# Altium schematic sheet USB-C.SchDoc
size A4; SheetNumber: 4; SheetTotal: 5
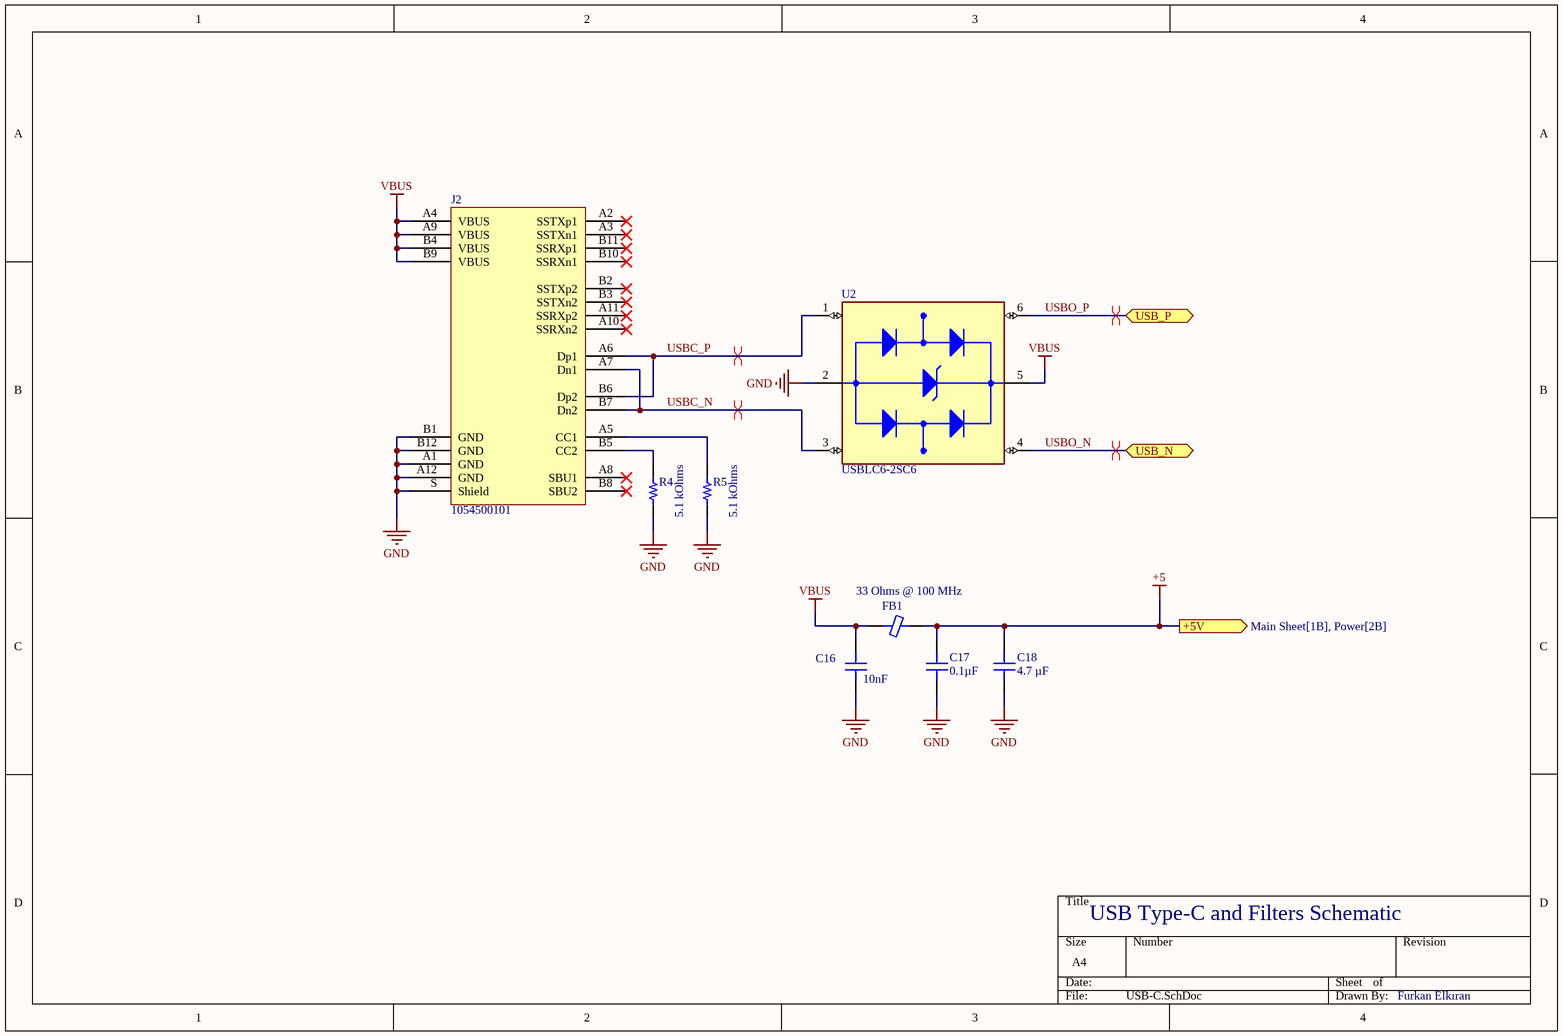
[diagram p0: USB-C.SchDoc]

## Parts
C16  Capacitance: 10nF  [CAP 0402_1005]  (hidden comment: 10000pF)
C17  0.1µF  [CAP 0402_1005]
C18  4.7 µF  [CAP 0805_2012]
FB1  33 Ohms @ 100 MHz  [FER 0402_1005]
J2  1054500101  [Molex 1054500101]
R4  5.1 kOhms  [YAGEO RES 0402_1005]
R5  5.1 kOhms  [YAGEO RES 0402_1005]
U2  USBLC6-2SC6  [SOT95P280X145-6N]

## Ports
+5V (out, see Main Sheet[1B], Power[2B]), USB_N (bidir, see Main Sheet[2B], ESP32-S3[3B]), USB_P (bidir, see Main Sheet[2B], ESP32-S3[3B])

## Nets
+5: C17.2 C18.2 FB1.2 ; port +5V
GND: C16.1 C17.1 C18.1 J2.A1(GND) J2.A12(GND) J2.B1(GND) J2.B12(GND) J2.S(Shield) R4.1 R5.1 U2.2(GND)
VBUS: C16.2 FB1.1 J2.A4(VBUS) J2.A9(VBUS) J2.B4(VBUS) J2.B9(VBUS) U2.5(VBUS)
USBC_N: J2.A7(Dn1) J2.B7(Dn2) U2.3(I/O2_IN)
USBC_P: J2.A6(Dp1) J2.B6(Dp2) U2.1(I/O1_IN)
USBO_N: U2.4(I/O2_OUT) ; port USB_N
USBO_P: U2.6(I/O1_OUT) ; port USB_P
NetJ2_A5: J2.A5(CC1) R5.2
NetJ2_B5: J2.B5(CC2) R4.2

Not connected (* = marked no-connect by the designer): J2 A2(SSTXp1)* A3(SSTXn1)* A8(SBU1)* A10(SSRXn2)* A11(SSRXp2)* B2(SSTXp2)* B3(SSTXn2)* B8(SBU2)* B10(SSRXn1)* B11(SSRXp1)*

## Layout directives
differential pair: USBC_N, USBC_P, USBO_N, USBO_P

## Notes on the sheet
- USB Type-C and Filters Schematic
- Furkan Elkıran

## Library data of the parts
C16 = 0402YC103JAT4A: CAP CER 10000PF 16V X7R 0402; manufacturer: AVX Corporation; Tolerance: ±5%; Part Number: 0402YC103JAT4A; Applications: General Purpose; componentlink1description: Datasheet; componentlink1url: http://datasheets.avx.com/X7RDielectric.pdf; componentlink2description: DigiKey Link; componentlink2url: http://digikey.com/product-detail/en/avx-corporation/0402YC103JAT4A/478-12448-1-ND/9749300; Device Package: 0402 (1005 Metric); lastupdated: 8.02.2022 12:26:50; Lifecycle Status: Active; Minimum Order: 1; Mounting Type: Surface Mount, MLCC; Operating Temperature: -55°C ~ 125°C; Package / Case: 0402 (1005 Metric); packaging: TapeAndReel; partid: 6953; Part Status: Active; price: 0.06; series: -; Size / Dimension: 0.039" L x 0.020" W (1.00mm x 0.50mm); Supplier 1: DigiKey; Supplier Part Number 1: 478-12448-1-ND; Temperature Coefficient: X7R; Thickness (Max): 0.022" (0.56mm); value: 10000pF; Voltage - Rated: 16V
C17 = 0402YC104JAT4A: CAP CER 0.1UF 16V X7R 0402; manufacturer: AVX Corporation; Tolerance: ±5%; Part Number: 0402YC104JAT4A; Capacitance: 0.1µF; Applications: General Purpose; componentlink1description: Datasheet; componentlink1url: http://datasheets.avx.com/X7RDielectric.pdf; componentlink2description: DigiKey Link; componentlink2url: http://digikey.com/product-detail/en/avx-corporation/0402YC104JAT4A/478-11502-1-ND/8107703; Device Package: 0402 (1005 Metric); lastupdated: 8.02.2022 12:26:57; Lifecycle Status: Active; Minimum Order: 1; Mounting Type: Surface Mount, MLCC; Operating Temperature: -55°C ~ 125°C; Package / Case: 0402 (1005 Metric); packaging: CutTape; partid: 2382; Part Status: Active; price: 0.10; series: -; Size / Dimension: 0.039" L x 0.020" W (1.00mm x 0.50mm); Supplier 1: DigiKey; Supplier Part Number 1: 478-11502-1-ND; Temperature Coefficient: X7R; Thickness (Max): 0.022" (0.56mm); value: 0.1µF; Voltage - Rated: 16V
C18 = C0805C475J4RACAUTO: CAP CER 4.7UF 16V X7R 0805; manufacturer: KEMET; Tolerance: ±5%; Part Number: C0805C475J4RACAUTO; Capacitance: 4.7 µF; Applications: Automotive, Bypass, Decoupling; componentlink1description: Datasheet; componentlink1url: https://api.kemet.com/component-edge/download/datasheet/C0805C475J4RACAUTO.pdf; componentlink2description: DigiKey Link; componentlink2url: https://www.digikey.com/en/products/detail/kemet/C0805C475J4RACAUTO/7427546; Device Package: 0805 (2012 Metric); lastupdated: 9.02.2024 20:15:37; Lifecycle Status: Active; Minimum Order: 1; Mounting Type: Surface Mount, MLCC; Operating Temperature: -55°C ~ 125°C; Package / Case: 0805 (2012 Metric); packaging: TapeAndReel; partid: 39263; Part Status: Active; price: 0.12; Ratings: AEC-Q200; series: SMD Auto X7R; Size / Dimension: 0.079" L x 0.049" W (2.00mm x 1.25mm); Supplier 1: DigiKey; Supplier Part Number 1: 399-15716-1-ND; Temperature Coefficient: X7R; Thickness (Max): 0.055" (1.40mm); value: 4.7 µF; Voltage - Rated: 16V
FB1 = FB100505T-330Y-S: FBEAD 0402 33 OHM .40DC 300MA; Manufacturer: Cal-Chip Electronics, Inc.; DC Resistance (DCR) (Max): 400mOhm; Filter Type: Signal Line; Number of Lines: 1; Part Number: FB100505T-330Y-S; ComponentLink1Description: Datasheet; ComponentLink1URL: https://calchip.com/wp-content/uploads/2023/05/fb_series.pdf; ComponentLink2Description: DigiKey Link; ComponentLink2URL: https://www.digikey.com/en/products/detail/cal-chip-electronics-inc/FB100505T-330Y-S/22463427; Current Rating (Max): 300mA; Device Package: 0402 (1005 Metric); Height (Max): 0.024" (0.60mm); Impedance @ Frequency: 33 Ohms @ 100 MHz; LastUpdated: 3.06.2024 19:50:49; Lifecycle Status: Active; Minimum Order: 1; Mounting Type: Surface Mount; Operating Temperature: -55°C ~ 125°C; Package / Case: 0402 (1005 Metric); Packaging: TapeAndReel; PartId: 3685; Price: 0.02; Series: FB; Size / Dimension: 0.039" L x 0.020" W (1.00mm x 0.50mm); Supplier 1: DigiKey; Supplier Part Number 1: 4713-FB100505T-330Y-SCT-ND; Value: 33 Ohms @ 100 MHz
J2 = 1054500101: CONN RCP USB3.1 TYPEC 24P SMD RA; Manufacturer: Molex; Connector Type: USB - C (Type - C); Current Rating (Amps): 0.25A, 1A, 5A; Gender: Receptacle; Mating Cycles: 10000; Number of Contacts: 24; Number of Ports: 1; Shielding: Shielded; Specifications: USB 3.1 (USB 3.1 Gen 2, Superspeed+); Voltage - Rated: 30VAC/DC; Part Number: 1054500101; ComponentLink1Description: Datasheet; ComponentLink1URL: https://www.molex.com/pdm_docs/ps/PS-105448-001.pdf; ComponentLink2Description: DigiKey Link; ComponentLink2URL: http://digikey.com/product-detail/en/molex/1054500101/WM12856CT-ND/5843891; LastUpdated: 6.06.2020 02:14:04; Lifecycle Status: Active; Minimum Order: 1; Mounting Feature: Horizontal; Mounting Type: Surface Mount, Right Angle; Through Hole; Operating Temperature: -30°C ~ 85°C; Packaging: TapeAndReel; Part Status: Active; Price: 1.22; Series: 105445; Supplier 1: DigiKey; Supplier Part Number 1: WM12856CT-ND; Termination: Solder
R4 R5 = AC0402JR-075K1L: RES SMD 5.1K OHM 5% 1/16W 0402; Manufacturer: Yageo; Power (Watts): 0.063W, 1/16W; Temperature Coefficient: ±100ppm/°C; Part Number: AC0402JR-075K1L; Value: 5.1 kOhms; ComponentLink1Description: Datasheet; ComponentLink1URL: https://www.yageo.com/upload/media/product/productsearch/datasheet/rchip/PYu-AC_51_RoHS_L_7.pdf; ComponentLink2Description: DigiKey Link; ComponentLink2URL: https://www.digikey.com/en/products/detail/yageo/AC0402JR-075K1L/5895695; Composition: Thick Film; Device Package: 0402 (1005 Metric); Features: Automotive AEC-Q200, Moisture Resistant; Height - Seated (Max): 0.015" (0.37mm); LastUpdated: 31.08.2025 15:04:16; Lifecycle Status: Active; Minimum Order: 1; Number of Terminations: 2; Operating Temperature: -55°C ~ 155°C; Package / Case: 0402 (1005 Metric); Packaging: CutTape; PartId: 4690; Part Status: Active; Price: 0.01; Ratings: AEC-Q200; Resistance: 5.1 kOhms; Series: AC; Size / Dimension: 0.039" L x 0.020" W (1.00mm x 0.50mm); Supplier 1: DigiKey; Supplier Part Number 1: YAG3554CT-ND; Supplier Device Package: 0402; Tolerance: ±5%
U2 = USBLC6-2SC6: 17V Clamp 5A (8/20Âµs) Ipp Tvs Diode Surface Mount SOT-23-6; MF: STMicroelectronics; Value: *; SnapEDA_Link: https://www.snapeda.com/parts/USBLC6-2SC6/STMicroelectronics/view-part/?ref=snap; Check_prices: https://www.snapeda.com/parts/USBLC6-2SC6/STMicroelectronics/view-part/?ref=eda; Purchase-URL: https://pricing.snapeda.com/search/part/USBLC6-2SC6/?ref=eda; Price: None; Availability: In Stock; Package: SOT-23-6 STMicroelectronics; MP: USBLC6-2SC6